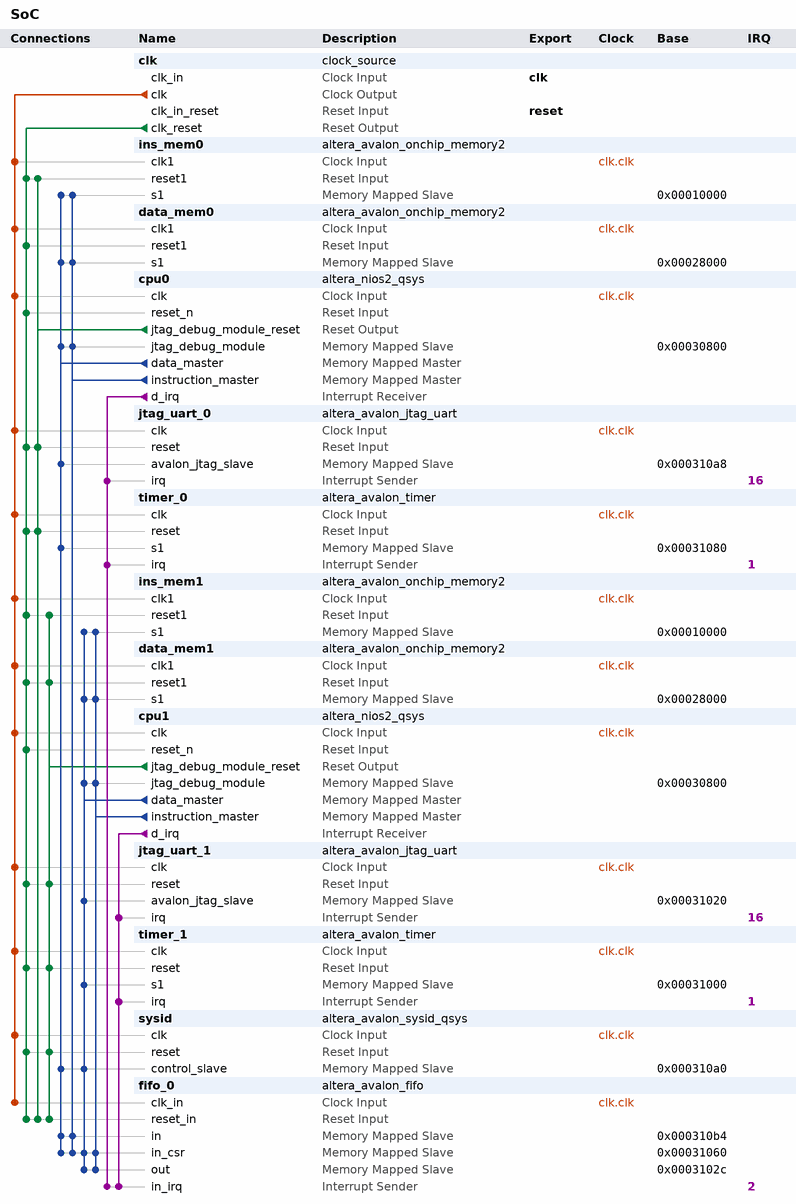
[diagram p0: system contents]
# Platform Designer (Qsys) system SoC, Cyclone IV E EP4CE115F29C7
# Parameters at their usual value, and those the tool derives, are not listed.
package require -exact qsys 12.1
create_system SoC
set_project_property DEVICE_FAMILY {Cyclone IV E}
set_project_property DEVICE EP4CE115F29C7

add_instance clk clock_source 12.1
set_instance_parameter_value clk clockFrequency 50000000

add_instance ins_mem0 altera_avalon_onchip_memory2 12.1
set_instance_parameter_value ins_mem0 dataWidth 32
set_instance_parameter_value ins_mem0 dualPort false
set_instance_parameter_value ins_mem0 initMemContent true
set_instance_parameter_value ins_mem0 initializationFileName ins_mem0
set_instance_parameter_value ins_mem0 memorySize 65536

add_instance data_mem0 altera_avalon_onchip_memory2 12.1
set_instance_parameter_value data_mem0 dataWidth 32
set_instance_parameter_value data_mem0 dualPort false
set_instance_parameter_value data_mem0 initMemContent true
set_instance_parameter_value data_mem0 initializationFileName data_mem0
set_instance_parameter_value data_mem0 memorySize 32768

add_instance cpu0 altera_nios2_qsys 12.1
set_instance_parameter_value cpu0 resetSlave ins_mem0.s1
set_instance_parameter_value cpu0 exceptionSlave ins_mem0.s1
set_instance_parameter_value cpu0 breakSlave cpu0.jtag_debug_module
set_instance_parameter_value cpu0 impl Small
set_instance_parameter_value cpu0 icache_size 4096

add_instance jtag_uart_0 altera_avalon_jtag_uart 12.1
set_instance_parameter_value jtag_uart_0 simInteractiveOptions INTERACTIVE_ASCII_OUTPUT

add_instance timer_0 altera_avalon_timer 12.1
set_instance_parameter_value timer_0 period 1
set_instance_parameter_value timer_0 periodUnits MSEC
set_instance_parameter_value timer_0 timerPreset FULL_FEATURED

add_instance ins_mem1 altera_avalon_onchip_memory2 12.1
set_instance_parameter_value ins_mem1 dataWidth 32
set_instance_parameter_value ins_mem1 dualPort false
set_instance_parameter_value ins_mem1 initMemContent true
set_instance_parameter_value ins_mem1 initializationFileName ins_mem1
set_instance_parameter_value ins_mem1 memorySize 65536

add_instance data_mem1 altera_avalon_onchip_memory2 12.1
set_instance_parameter_value data_mem1 dataWidth 32
set_instance_parameter_value data_mem1 dualPort false
set_instance_parameter_value data_mem1 initMemContent true
set_instance_parameter_value data_mem1 initializationFileName data_mem1
set_instance_parameter_value data_mem1 memorySize 32768

add_instance cpu1 altera_nios2_qsys 12.1
set_instance_parameter_value cpu1 resetSlave ins_mem1.s1
set_instance_parameter_value cpu1 exceptionSlave ins_mem1.s1
set_instance_parameter_value cpu1 breakSlave cpu1.jtag_debug_module
set_instance_parameter_value cpu1 impl Small
set_instance_parameter_value cpu1 icache_size 4096

add_instance jtag_uart_1 altera_avalon_jtag_uart 12.1
set_instance_parameter_value jtag_uart_1 simInteractiveOptions INTERACTIVE_ASCII_OUTPUT

add_instance timer_1 altera_avalon_timer 12.1
set_instance_parameter_value timer_1 period 1
set_instance_parameter_value timer_1 periodUnits MSEC
set_instance_parameter_value timer_1 timerPreset FULL_FEATURED

add_instance sysid altera_avalon_sysid_qsys 12.1
set_instance_parameter_value sysid id 0

add_instance fifo_0 altera_avalon_fifo 12.1
set_instance_parameter_value fifo_0 bitsPerSymbol 16
set_instance_parameter_value fifo_0 channelWidth 8
set_instance_parameter_value fifo_0 errorWidth 8
set_instance_parameter_value fifo_0 fifoDepth 64
set_instance_parameter_value fifo_0 fifoInputInterfaceOptions AVALONMM_WRITE
set_instance_parameter_value fifo_0 fifoOutputInterfaceOptions AVALONMM_READ
set_instance_parameter_value fifo_0 singleClockMode true
set_instance_parameter_value fifo_0 symbolsPerBeat 2
set_instance_parameter_value fifo_0 useIRQ true
set_instance_parameter_value fifo_0 usePacket true
set_instance_parameter_value fifo_0 useReadControl false

# connections
add_connection clk.clk cpu0.clk clock
add_connection clk.clk cpu1.clk clock
add_connection clk.clk data_mem0.clk1 clock
add_connection clk.clk data_mem1.clk1 clock
add_connection clk.clk fifo_0.clk_in clock
add_connection clk.clk ins_mem0.clk1 clock
add_connection clk.clk ins_mem1.clk1 clock
add_connection clk.clk jtag_uart_0.clk clock
add_connection clk.clk jtag_uart_1.clk clock
add_connection clk.clk sysid.clk clock
add_connection clk.clk timer_0.clk clock
add_connection clk.clk timer_1.clk clock
add_connection clk.clk_reset cpu0.reset_n reset
add_connection clk.clk_reset cpu1.reset_n reset
add_connection clk.clk_reset data_mem0.reset1 reset
add_connection clk.clk_reset data_mem1.reset1 reset
add_connection clk.clk_reset fifo_0.reset_in reset
add_connection clk.clk_reset ins_mem0.reset1 reset
add_connection clk.clk_reset ins_mem1.reset1 reset
add_connection clk.clk_reset jtag_uart_0.reset reset
add_connection clk.clk_reset jtag_uart_1.reset reset
add_connection clk.clk_reset sysid.reset reset
add_connection clk.clk_reset timer_0.reset reset
add_connection clk.clk_reset timer_1.reset reset
add_connection cpu0.jtag_debug_module_reset fifo_0.reset_in reset
add_connection cpu0.jtag_debug_module_reset ins_mem0.reset1 reset
add_connection cpu0.jtag_debug_module_reset jtag_uart_0.reset reset
add_connection cpu0.jtag_debug_module_reset timer_0.reset reset
add_connection cpu1.jtag_debug_module_reset data_mem1.reset1 reset
add_connection cpu1.jtag_debug_module_reset fifo_0.reset_in reset
add_connection cpu1.jtag_debug_module_reset ins_mem1.reset1 reset
add_connection cpu1.jtag_debug_module_reset jtag_uart_1.reset reset
add_connection cpu1.jtag_debug_module_reset sysid.reset reset
add_connection cpu1.jtag_debug_module_reset timer_1.reset reset
add_connection cpu0.data_master cpu0.jtag_debug_module avalon
set_connection_parameter_value cpu0.data_master/cpu0.jtag_debug_module baseAddress 0x00030800
add_connection cpu0.data_master data_mem0.s1 avalon
set_connection_parameter_value cpu0.data_master/data_mem0.s1 baseAddress 0x00028000
add_connection cpu0.data_master fifo_0.in avalon
set_connection_parameter_value cpu0.data_master/fifo_0.in baseAddress 0x000310b4
add_connection cpu0.data_master fifo_0.in_csr avalon
set_connection_parameter_value cpu0.data_master/fifo_0.in_csr baseAddress 0x00031060
add_connection cpu0.data_master ins_mem0.s1 avalon
set_connection_parameter_value cpu0.data_master/ins_mem0.s1 baseAddress 0x00010000
add_connection cpu0.data_master jtag_uart_0.avalon_jtag_slave avalon
set_connection_parameter_value cpu0.data_master/jtag_uart_0.avalon_jtag_slave baseAddress 0x000310a8
add_connection cpu0.data_master sysid.control_slave avalon
set_connection_parameter_value cpu0.data_master/sysid.control_slave baseAddress 0x000310a0
add_connection cpu0.data_master timer_0.s1 avalon
set_connection_parameter_value cpu0.data_master/timer_0.s1 baseAddress 0x00031080
add_connection cpu0.instruction_master cpu0.jtag_debug_module avalon
set_connection_parameter_value cpu0.instruction_master/cpu0.jtag_debug_module baseAddress 0x00030800
add_connection cpu0.instruction_master data_mem0.s1 avalon
set_connection_parameter_value cpu0.instruction_master/data_mem0.s1 baseAddress 0x00028000
add_connection cpu0.instruction_master fifo_0.in avalon
set_connection_parameter_value cpu0.instruction_master/fifo_0.in baseAddress 0x000310b4
add_connection cpu0.instruction_master fifo_0.in_csr avalon
set_connection_parameter_value cpu0.instruction_master/fifo_0.in_csr baseAddress 0x00031060
add_connection cpu0.instruction_master ins_mem0.s1 avalon
set_connection_parameter_value cpu0.instruction_master/ins_mem0.s1 baseAddress 0x00010000
add_connection cpu1.data_master cpu1.jtag_debug_module avalon
set_connection_parameter_value cpu1.data_master/cpu1.jtag_debug_module baseAddress 0x00030800
add_connection cpu1.data_master data_mem1.s1 avalon
set_connection_parameter_value cpu1.data_master/data_mem1.s1 baseAddress 0x00028000
add_connection cpu1.data_master fifo_0.in_csr avalon
set_connection_parameter_value cpu1.data_master/fifo_0.in_csr baseAddress 0x00031060
add_connection cpu1.data_master fifo_0.out avalon
set_connection_parameter_value cpu1.data_master/fifo_0.out baseAddress 0x0003102c
add_connection cpu1.data_master ins_mem1.s1 avalon
set_connection_parameter_value cpu1.data_master/ins_mem1.s1 baseAddress 0x00010000
add_connection cpu1.data_master jtag_uart_1.avalon_jtag_slave avalon
set_connection_parameter_value cpu1.data_master/jtag_uart_1.avalon_jtag_slave baseAddress 0x00031020
add_connection cpu1.data_master sysid.control_slave avalon
set_connection_parameter_value cpu1.data_master/sysid.control_slave baseAddress 0x000310a0
add_connection cpu1.data_master timer_1.s1 avalon
set_connection_parameter_value cpu1.data_master/timer_1.s1 baseAddress 0x00031000
add_connection cpu1.instruction_master cpu1.jtag_debug_module avalon
set_connection_parameter_value cpu1.instruction_master/cpu1.jtag_debug_module baseAddress 0x00030800
add_connection cpu1.instruction_master data_mem1.s1 avalon
set_connection_parameter_value cpu1.instruction_master/data_mem1.s1 baseAddress 0x00028000
add_connection cpu1.instruction_master fifo_0.in_csr avalon
set_connection_parameter_value cpu1.instruction_master/fifo_0.in_csr baseAddress 0x00031060
add_connection cpu1.instruction_master fifo_0.out avalon
set_connection_parameter_value cpu1.instruction_master/fifo_0.out baseAddress 0x0003102c
add_connection cpu1.instruction_master ins_mem1.s1 avalon
set_connection_parameter_value cpu1.instruction_master/ins_mem1.s1 baseAddress 0x00010000
add_connection cpu0.d_irq fifo_0.in_irq interrupt
set_connection_parameter_value cpu0.d_irq/fifo_0.in_irq irqNumber 2
add_connection cpu0.d_irq jtag_uart_0.irq interrupt
set_connection_parameter_value cpu0.d_irq/jtag_uart_0.irq irqNumber 16
add_connection cpu0.d_irq timer_0.irq interrupt
set_connection_parameter_value cpu0.d_irq/timer_0.irq irqNumber 1
add_connection cpu1.d_irq fifo_0.in_irq interrupt
set_connection_parameter_value cpu1.d_irq/fifo_0.in_irq irqNumber 2
add_connection cpu1.d_irq jtag_uart_1.irq interrupt
set_connection_parameter_value cpu1.d_irq/jtag_uart_1.irq irqNumber 16
add_connection cpu1.d_irq timer_1.irq interrupt
set_connection_parameter_value cpu1.d_irq/timer_1.irq irqNumber 1

# exported interfaces
add_interface clk clock sink
set_interface_property clk EXPORT_OF clk.clk_in
add_interface reset reset sink
set_interface_property reset EXPORT_OF clk.clk_in_reset

save_system SoC.qsys
